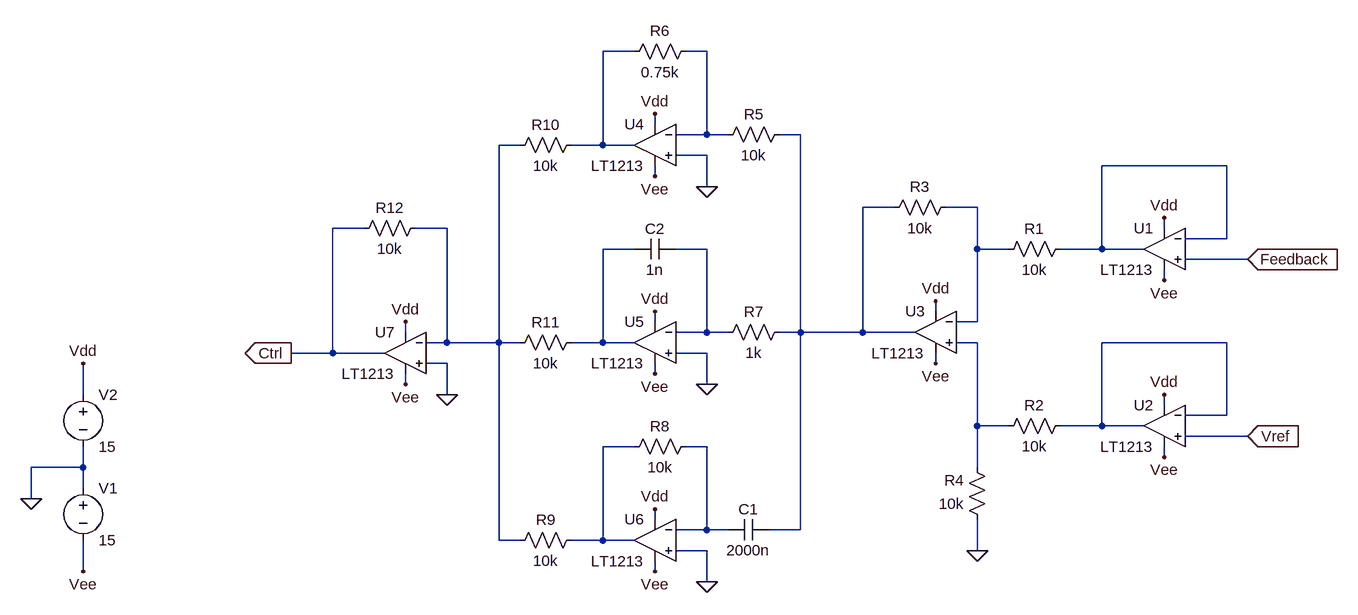
[diagram p0: schematic PID_controller.asc]
PID_controller.asc, the LTspice schematic file:
Version 4
SHEET 1 880 680
WIRE -240 -624 -288 -624
WIRE -128 -624 -160 -624
WIRE -208 -512 -208 -528
WIRE -128 -496 -128 -624
WIRE -128 -496 -176 -496
WIRE -96 -496 -128 -496
WIRE 16 -496 -16 -496
WIRE -416 -480 -448 -480
WIRE -288 -480 -288 -624
WIRE -288 -480 -336 -480
WIRE -240 -480 -288 -480
WIRE -128 -464 -176 -464
WIRE 672 -448 480 -448
WIRE -208 -432 -208 -448
WIRE -128 -416 -128 -464
WIRE 160 -384 112 -384
WIRE 288 -384 240 -384
WIRE -656 -352 -704 -352
WIRE -528 -352 -576 -352
WIRE 576 -352 576 -368
WIRE 672 -336 672 -448
WIRE 672 -336 608 -336
WIRE -240 -320 -288 -320
WIRE -128 -320 -176 -320
WIRE 288 -320 288 -384
WIRE 336 -320 288 -320
WIRE 480 -320 480 -448
WIRE 480 -320 416 -320
WIRE 544 -320 480 -320
WIRE 704 -304 608 -304
WIRE 576 -272 576 -288
WIRE 224 -224 224 -240
WIRE -208 -208 -208 -224
WIRE 288 -208 288 -320
WIRE 288 -208 256 -208
WIRE -592 -192 -592 -208
WIRE -128 -192 -128 -320
WIRE -128 -192 -176 -192
WIRE -96 -192 -128 -192
WIRE 16 -192 16 -496
WIRE 16 -192 -16 -192
WIRE 112 -192 112 -384
WIRE 112 -192 16 -192
WIRE 192 -192 112 -192
WIRE -528 -176 -528 -352
WIRE -528 -176 -560 -176
WIRE -448 -176 -448 -480
WIRE -448 -176 -528 -176
WIRE -416 -176 -448 -176
WIRE -288 -176 -288 -320
WIRE -288 -176 -336 -176
WIRE -240 -176 -288 -176
WIRE 288 -176 256 -176
WIRE 672 -176 480 -176
WIRE -704 -160 -704 -352
WIRE -704 -160 -768 -160
WIRE -624 -160 -704 -160
WIRE -128 -160 -176 -160
WIRE -528 -144 -560 -144
WIRE 224 -144 224 -160
WIRE -208 -128 -208 -144
WIRE -592 -112 -592 -128
WIRE -128 -112 -128 -160
WIRE -1088 -96 -1088 -144
WIRE -528 -96 -528 -144
WIRE 576 -80 576 -96
WIRE 672 -64 672 -176
WIRE 672 -64 608 -64
WIRE 288 -48 288 -176
WIRE 336 -48 288 -48
WIRE 480 -48 480 -176
WIRE 480 -48 416 -48
WIRE 544 -48 480 -48
WIRE 704 -32 608 -32
WIRE -240 -16 -288 -16
WIRE -128 -16 -160 -16
WIRE 576 0 576 -16
WIRE -1088 16 -1088 -16
WIRE -1088 16 -1168 16
WIRE 288 16 288 -48
WIRE -1088 48 -1088 16
WIRE -1168 64 -1168 16
WIRE -208 96 -208 80
WIRE -128 112 -128 -16
WIRE -128 112 -176 112
WIRE -96 112 -128 112
WIRE 16 112 16 -192
WIRE 16 112 -32 112
WIRE -448 128 -448 -176
WIRE -416 128 -448 128
WIRE -288 128 -288 -16
WIRE -288 128 -336 128
WIRE -240 128 -288 128
WIRE -128 144 -176 144
WIRE 288 144 288 96
WIRE -1088 176 -1088 128
WIRE -208 176 -208 160
WIRE -128 192 -128 144
FLAG 576 -368 Vdd
FLAG 576 -96 Vdd
FLAG 576 -272 Vee
FLAG 576 0 Vee
FLAG 704 -304 Feedback
IOPIN 704 -304 In
FLAG 704 -32 Vref
IOPIN 704 -32 In
FLAG 224 -240 Vdd
FLAG 224 -144 Vee
FLAG -208 -528 Vdd
FLAG -208 -432 Vee
FLAG -208 -224 Vdd
FLAG -208 -128 Vee
FLAG -208 80 Vdd
FLAG -208 176 Vee
FLAG 288 144 0
FLAG -128 -416 0
FLAG -128 -112 0
FLAG -128 192 0
FLAG -592 -208 Vdd
FLAG -592 -112 Vee
FLAG -528 -96 0
FLAG -768 -160 Ctrl
IOPIN -768 -160 Out
FLAG -1168 64 0
FLAG -1088 176 Vee
FLAG -1088 -144 Vdd
SYMBOL OpAmps\\LT1213 576 -384 M0
SYMATTR InstName U1
SYMBOL OpAmps\\LT1213 576 -112 M0
SYMATTR InstName U2
SYMBOL OpAmps\\LT1213 224 -256 M0
SYMATTR InstName U3
SYMBOL OpAmps\\LT1213 -208 -544 M0
SYMATTR InstName U4
SYMBOL OpAmps\\LT1213 -208 -240 M0
SYMATTR InstName U5
SYMBOL OpAmps\\LT1213 -208 64 M0
SYMATTR InstName U6
SYMBOL res 432 -336 R90
WINDOW 0 0 56 VBottom 2
WINDOW 3 32 56 VTop 2
SYMATTR InstName R1
SYMATTR Value 10k
SYMBOL res 432 -64 R90
WINDOW 0 0 56 VBottom 2
WINDOW 3 32 56 VTop 2
SYMATTR InstName R2
SYMATTR Value 10k
SYMBOL res 256 -400 R90
WINDOW 0 0 56 VBottom 2
WINDOW 3 32 56 VTop 2
SYMATTR InstName R3
SYMATTR Value 10k
SYMBOL res 304 112 R180
WINDOW 0 36 76 Left 2
WINDOW 3 36 40 Left 2
SYMATTR InstName R4
SYMATTR Value 10k
SYMBOL res 0 -512 R90
WINDOW 0 0 56 VBottom 2
WINDOW 3 32 56 VTop 2
SYMATTR InstName R5
SYMATTR Value 10k
SYMBOL res -144 -640 R90
WINDOW 0 0 56 VBottom 2
WINDOW 3 32 56 VTop 2
SYMATTR InstName R6
SYMATTR Value 0.75k
SYMBOL res 0 -208 R90
WINDOW 0 0 56 VBottom 2
WINDOW 3 32 56 VTop 2
SYMATTR InstName R7
SYMATTR Value 1k
SYMBOL res -144 -32 R90
WINDOW 0 0 56 VBottom 2
WINDOW 3 32 56 VTop 2
SYMATTR InstName R8
SYMATTR Value 10k
SYMBOL res -320 112 R90
WINDOW 0 0 56 VBottom 2
WINDOW 3 32 56 VTop 2
SYMATTR InstName R9
SYMATTR Value 10k
SYMBOL res -320 -496 R90
WINDOW 0 0 56 VBottom 2
WINDOW 3 32 56 VTop 2
SYMATTR InstName R10
SYMATTR Value 10k
SYMBOL res -320 -192 R90
WINDOW 0 0 56 VBottom 2
WINDOW 3 32 56 VTop 2
SYMATTR InstName R11
SYMATTR Value 10k
SYMBOL cap -32 96 R90
WINDOW 0 0 32 VBottom 2
WINDOW 3 32 32 VTop 2
SYMATTR InstName C1
SYMATTR Value 2000n
SYMBOL cap -176 -336 R90
WINDOW 0 0 32 VBottom 2
WINDOW 3 32 32 VTop 2
SYMATTR InstName C2
SYMATTR Value 1n
SYMBOL OpAmps\\LT1213 -592 -224 M0
SYMATTR InstName U7
SYMBOL res -560 -368 R90
WINDOW 0 0 56 VBottom 2
WINDOW 3 32 56 VTop 2
SYMATTR InstName R12
SYMATTR Value 10k
SYMBOL voltage -1088 32 R0
SYMATTR InstName V1
SYMATTR Value 15
SYMBOL voltage -1088 -112 R0
SYMATTR InstName V2
SYMATTR Value 15

The netlist it stands for:
* PID_controller.asc
XU1 Feedback N005 Vdd Vee N005 LT1213  ; pins In+ In- V+ V- OUT
XU2 Vref N010 Vdd Vee N010 LT1213  ; pins In+ In- V+ V- OUT
XU3 N009 N006 Vdd Vee N003 LT1213  ; pins In+ In- V+ V- OUT
XU4 0 N002 Vdd Vee N001 LT1213  ; pins In+ In- V+ V- OUT
XU5 0 N008 Vdd Vee N007 LT1213  ; pins In+ In- V+ V- OUT
XU6 0 N012 Vdd Vee N011 LT1213  ; pins In+ In- V+ V- OUT
R1 N005 N006 10k
R2 N010 N009 10k
R3 N006 N003 10k
R4 0 N009 10k
R5 N003 N002 10k
R6 N002 N001 0.75k
R7 N003 N008 1k
R8 N012 N011 10k
R9 N011 N004 10k
R10 N001 N004 10k
R11 N007 N004 10k
C1 N003 N012 2000n
C2 N008 N007 1n
XU7 0 N004 Vdd Vee Ctrl LT1213  ; pins In+ In- V+ V- OUT
R12 N004 Ctrl 10k
V1 0 Vee 15
V2 Vdd 0 15
.lib LTC.lib
.backanno
.end